# EAGLE design 808sn (EAGLE 7.2.0)
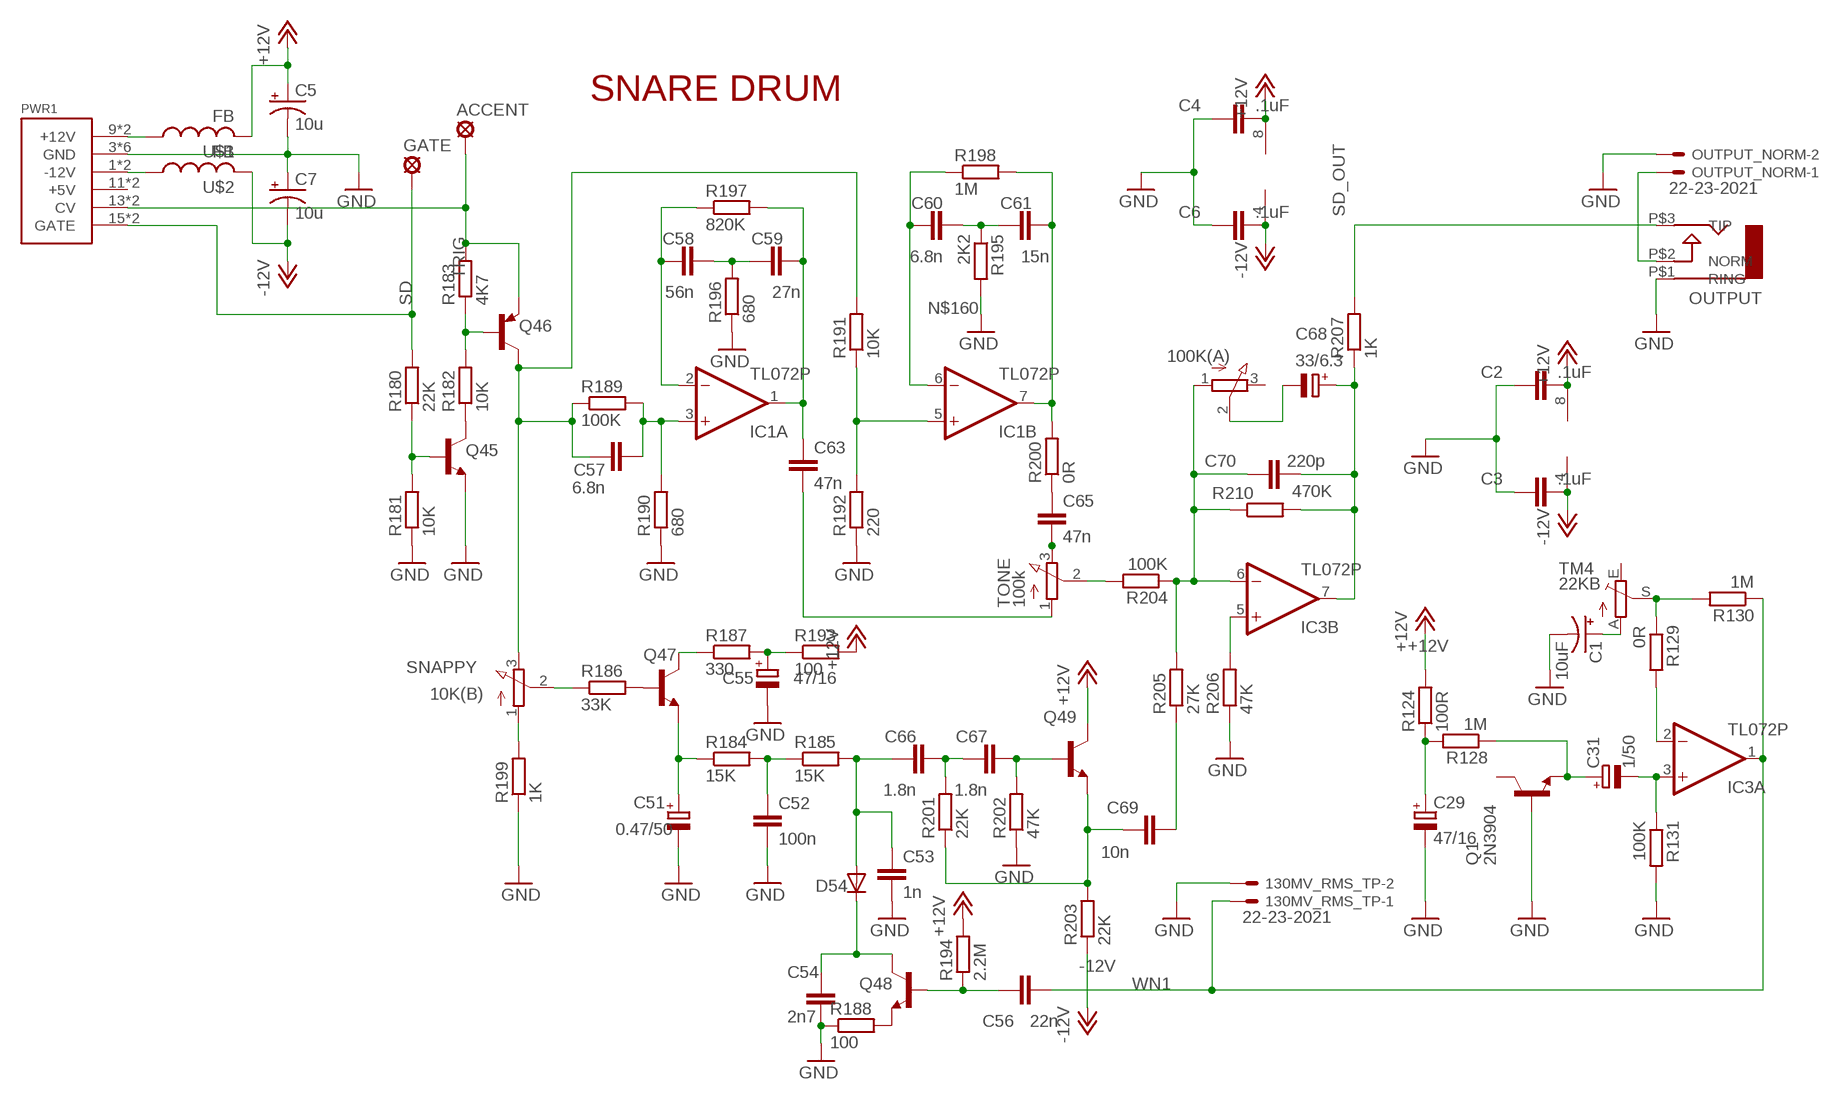
[diagram p0: schematic, sheet 1]

## Parts
130MV_RMS_TP  22-23-2021  [22-23-2021]
ACCENT  LSP10  [LSP10]
C1  10uF  CPOL-USB45181A  [B45181A]
C2  .1uF  C-EU025-025X050  [C025-025X050]
C3  .1uF  C-EU025-025X050  [C025-025X050]
C4  .1uF  C-EU025-025X050  [C025-025X050]
C5  10u  CPOL-USB45181A  [B45181A]
C6  .1uF  C-EU050-025X075  [C050-025X075]
C7  10u  CPOL-USB45181A  [B45181A]
C29  47/16  CPOL-EUE2.5-5  [E2,5-5]
C31  1/50  CPOL-EUE3.5-8  [E3,5-8]
C51  0.47/50  CPOL-EUE3.5-8  [E3,5-8]
C52  100n  C-EU050-045X075  [C050-045X075]
C53  1n  C-EU3.5MM_PITCH  [C035-025X75]
C54  2n7  C-EU3.5MM_PITCH  [C035-025X75]
C55  47/16  CPOL-EUE2-5  [E2-5]
C56  22n  C-EU4MM_PITCH  [C035-030X60]
C57  6.8n  C-EU4MM_PITCH  [C035-030X60]
C58  56n  C-EU050-024X044  [C050-024X044]
C59  27n  C-EU050-024X044  [C050-024X044]
C60  6.8n  C-EU4MM_PITCH  [C035-030X60]
C61  15n  C-EU4MM_PITCH  [C035-030X60]
C63  47n  C-EU050-024X044  [C050-024X044]
C65  47n  C-EU050-024X044  [C050-024X044]
C66  1.8n  C-EU3.5MM_PITCH  [C035-025X75]
C67  1.8n  C-EU3.5MM_PITCH  [C035-025X75]
C68  33/6.3  CPOL-EUE2-5  [E2-5]
C69  10n  C-EU075-042X103  [C075-042X103]
C70  220p  C-EU025-025X050  [C025-025X050]
D54  1N4148DO35-7  [DO35-7]
GATE  LSP10  [LSP10]
IC1  TL072P  [DIL08]
IC3  TL072P  [DIL08]
LEVEL  100K(A)  3RP/1610N  [3RP/1610N]
OUTPUT  AUDIO-JACK  [ERTHENVAR-JACK-90DEG]
OUTPUT_NORM  22-23-2021  [22-23-2021]
PWR1  POWER  [POWER_16]
Q1  2N3904  [TO92]
Q45  2N3904  [TO92]
Q46  2N3906  [TO92]
Q47  2N3904  [TO92]
Q48  2N3904  [TO92]
Q49  2N3904  [TO92]
R124  100R  R-EU_0207/7  [0207/7]
R128  1M  R-EU_0207/7  [0207/7]
R129  0R  R-EU_0207/7  [0207/7]
R130  1M  R-EU_0207/7  [0207/7]
R131  100K  R-EU_0207/7  [0207/7]
R180  22K  R-EU_0207/5V  [0207/5V]
R181  10K  R-EU_0207/5V  [0207/5V]
R182  10K  R-EU_0207/5V  [0207/5V]
R183  4K7  R-EU_0207/2V  [0207/2V]
R184  15K  R-EU_0207/7  [0207/7]
R185  15K  R-EU_0207/7  [0207/7]
R186  33K  R-EU_0309/12  [0309/12]
R187  330  R-EU_0207/7  [0207/7]
R188  100  R-EU_0207/5V  [0207/5V]
R189  100K  R-EU_0207/5V  [0207/5V]
R190  680  R-EU_0207/5V  [0207/5V]
R191  10K  R-EU_0207/5V  [0207/5V]
R192  220  R-EU_0207/5V  [0207/5V]
R193  100  R-EU_0207/7  [0207/7]
R194  2.2M  R-EU_0207/7  [0207/7]
R195  2K2  R-EU_0207/7  [0207/7]
R196  680  R-EU_0207/7  [0207/7]
R197  820K  R-EU_0207/5V  [0207/5V]
R198  1M  R-EU_0207/5V  [0207/5V]
R199  1K  R-EU_0207/5V  [0207/5V]
R200  0R  R-EU_0207/5V  [0207/5V]
R201  22K  R-EU_0207/7  [0207/7]
R202  47K  R-EU_0207/5V  [0207/5V]
R203  22K  R-EU_0207/7  [0207/7]
R204  100K  R-EU_0207/7  [0207/7]
R205  27K  R-EU_0207/7  [0207/7]
R206  47K  R-EU_0207/5V  [0207/5V]
R207  1K  R-EU_0309/10  [0309/10]
R210  470K  R-EU_0207/5V  [0207/5V]
SNAPPY  10K(B)  3RP/1610N  [3RP/1610N]
TM4  22KB  TRIM_EU-B64Y  [B64Y]
TONE  100k  3RP/1610N  [3RP/1610N]
U$1  FB  [FB]
U$2  FB  [FB]

## Nets
+12V: C2.2 C4.2 C5.+ IC1.8(P:V+) IC3.8(P:V+) Q49.1(C) R124.2 R193.2 R194.2 U$1.P$2
-12V: C3.2 C6.2 C7.- IC1.4(P:V-) IC3.4(P:V-) R203.1 U$2.P$2
GND [GND]: 130MV_RMS_TP.2 C1.- C2.1 C3.1 C4.1 C5.- C6.1 C7.+ C29.- C51.- C52.2 C53.P$2 C54.P$2 C55.- OUTPUT.P$1(RING) OUTPUT_NORM.2 PWR1.3(GND) PWR1.4(GND) PWR1.5(GND) PWR1.6(GND) PWR1.7(GND) PWR1.8(GND) Q1.2(B) Q45.3(E) R131.2 R181.1 R188.1 R190.1 R192.1 R195.2 R196.1 R199.1 R202.1 R206.1
N$1: IC3.5(B:+IN) R206.2
N$2: OUTPUT.P$2(NORM) OUTPUT_NORM.1
N$3: C1.+ TM4.A
N$4: IC3.2(A:-IN) R129.2
N$5: Q45.2(B) R180.1 R181.2
N$6: Q46.2(B) R182.2 R183.1
N$7: Q45.1(C) R182.1
N$8: C57.P$2 IC1.3(A:+IN) R189.2 R190.2
N$9: C57.P$1 Q46.1(C) R189.1 R191.2 SNAPPY.3(E)
N$10: PWR1.9(+12V) PWR1.10(+12V) U$1.P$1
N$11: C58.1 IC1.2(A:-IN) R197.1
N$12: C59.2 C63.1 IC1.1(A:OUT) R197.2
N$13: C58.2 C59.1 R196.2
N$14: C61.P$2 IC1.7(B:OUT) R198.2 R200.2
N$15: C60.P$2 C61.P$1 R195.1
N$16: IC1.5(B:+IN) R191.1 R192.2
N$17: C63.2 TONE.1(A)
N$18: C65.2 TONE.3(E)
N$19: C65.1 R200.1
N$20: R199.2 SNAPPY.1(A)
N$21: C52.1 R184.2 R185.1
N$22: R186.1 SNAPPY.2(S)
N$23: Q47.2(B) R186.2
N$24: Q47.1(C) R187.1
N$25: C55.+ R187.2 R193.1
N$26: C51.+ Q47.3(E) R184.1
N$27: C53.P$1 C66.P$1 D54.A R185.2
N$28: C66.P$2 C67.P$1 R201.2
N$29: C67.P$2 Q49.2(B) R202.2
N$30: C69.1 Q49.3(E) R201.1 R203.2
N$31: Q48.3(E) R188.2
N$32: C54.P$1 D54.C Q48.1(C)
N$33: C56.P$1 Q48.2(B) R194.1
N$34: R204.2 TONE.2(S)
N$35: C70.1 IC3.6(B:-IN) LEVEL.1(A) R204.1 R205.2 R210.1
N$36: C69.2 R205.1
N$37: PWR1.1(-12V) PWR1.2(-12V) U$2.P$1
N$129: C68.+ C70.2 IC3.7(B:OUT) R207.1 R210.2
N$159: C68.- LEVEL.2(S)
N$160: C60.P$1 IC1.6(B:-IN) R198.1
N$280: C31.- IC3.3(A:+IN) R131.1
N$490: R129.1 R130.2 TM4.S
N$491: C31.+ Q1.3(E) R128.1
N$492: C29.+ R124.1 R128.2
SD: GATE.MP PWR1.15(GATE) PWR1.16(GATE) R180.2
SD_OUT: OUTPUT.P$3(TIP) R207.2
TRIG: ACCENT.MP PWR1.13(CV) PWR1.14(CV) Q46.3(E) R183.2
WN1: 130MV_RMS_TP.1 C56.P$2 IC3.1(A:OUT) R130.1
Unconnected: LEVEL.3(E) PWR1.11(+5V) PWR1.12(+5V) Q1.1(C) TM4.E

## Notes on the sheet
- SNARE DRUM

## Library data of the parts
130MV_RMS_TP OUTPUT_NORM = con-molex:22-23-2021: .100" (2.54mm) Center Header - 2 Pin; MF: MOLEX; MPN: 22-23-2021; OC_FARNELL: 1462926; OC_NEWARK: 25C3832
ACCENT GATE = solpad:LSP10: SOLDER PAD drill 1.0 mm, distributor Buerklin, 12H555
C1 C5 C7 = rcl:CPOL-US: POLARIZED CAPACITOR, American symbol
C2-C4 C6 C52-C54 C56-C61 C63 C65-C67 C69 C70 = TR808clone:C-EU: CAPACITOR, European symbol Pitch 3mm
C29 C31 C51 C55 C68 = TR808clone:CPOL-EU: POLARIZED CAPACITOR, European symbol
D54 = TR808clone:1N4148: DIODE high speed (Philips)
IC1 IC3 = linear:TL072: OP AMP
LEVEL SNAPPY TONE = pot:3RP/1610N: 16mm Potentiometer one level Source: http://www.alphapotentiometers.net/html/16mm_pot_2.html
OUTPUT = erthenvar:AUDIO-JACK: Switching Mono 3.5mm Audio Jack from Erthenvar.
PWR1 = eurorack:POWER
Q1 = transistor-npn:2N3904: NPN Transistor
Q45 Q47-Q49 = 808_lt:2N3904: NPN Transistor
Q46 = 808_lt:2N3906: PNP Transistor
R124 R128-R131 R180-R207 R210 = TR808clone:R-EU_: RESISTOR, European symbol
TM4 = TR808clone:TRIM_EU-: POTENTIOMETER
U$1 U$2 = adafruit:FB: Ferrite bead Digikey #P9821BK-ND

## Net classes
1 GND: width 1.016 mm, drill 1.016 mm, clearance 0.508 mm
2 Power: width 1.016 mm, drill 1.016 mm, clearance 0.508 mm
3 special: width 0.635 mm, drill 0.254 mm, clearance 0.254 mm
4 15v: width 1.524 mm, drill 1.016 mm, clearance 0.508 mm

## Board
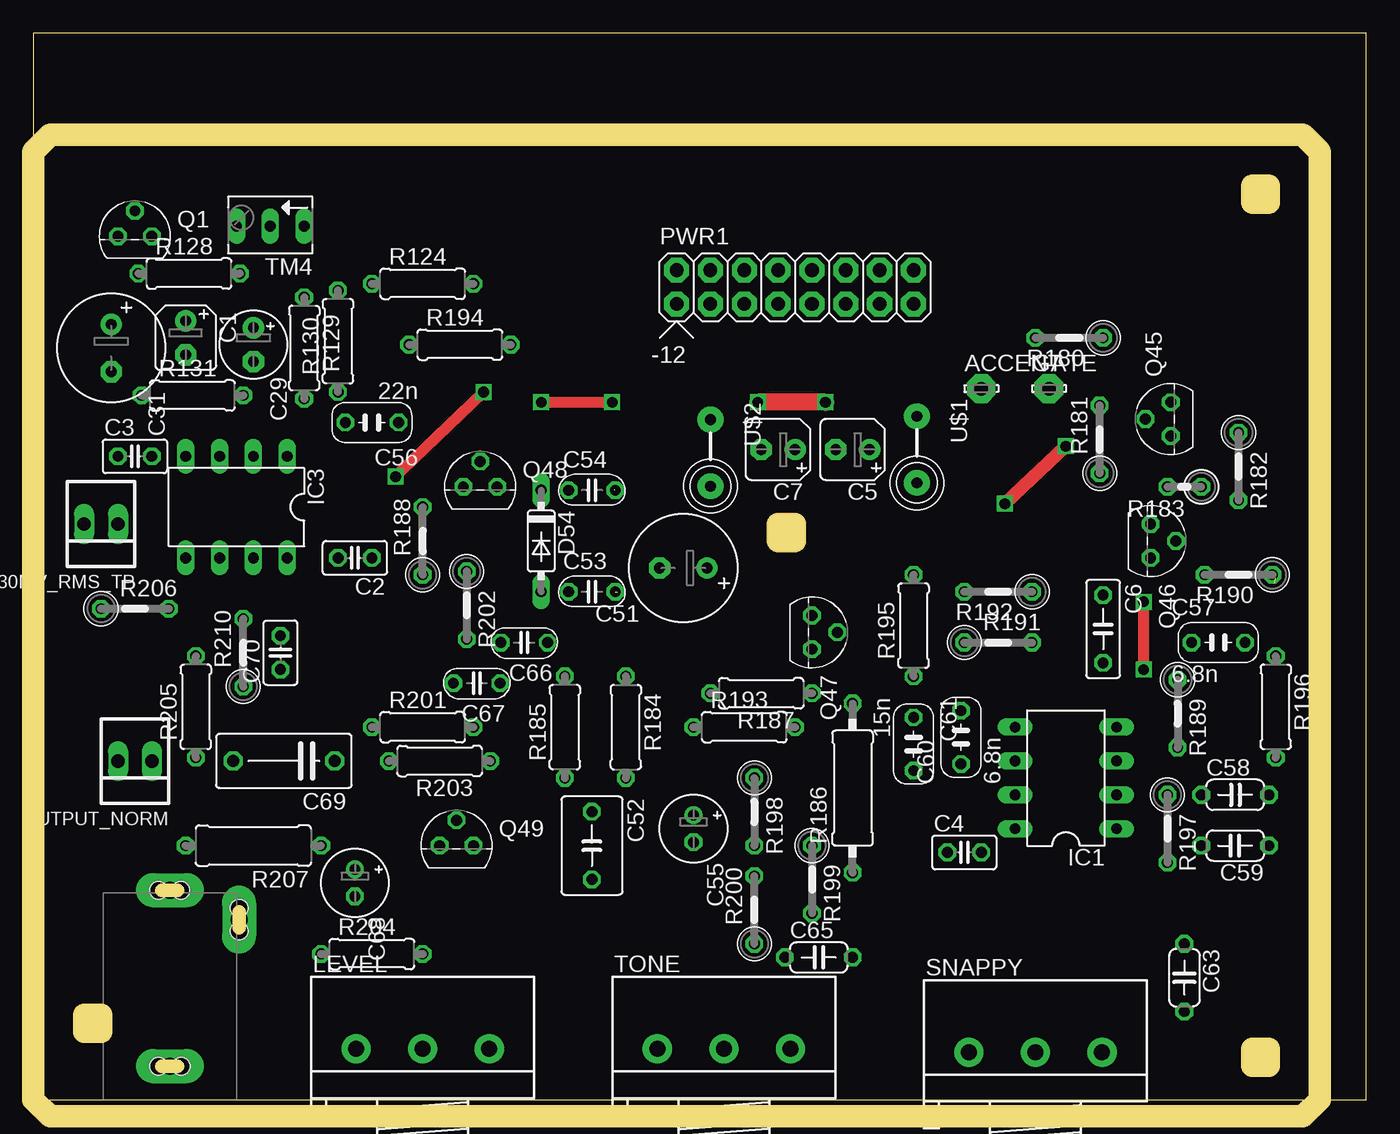
[diagram p1: board, top side]
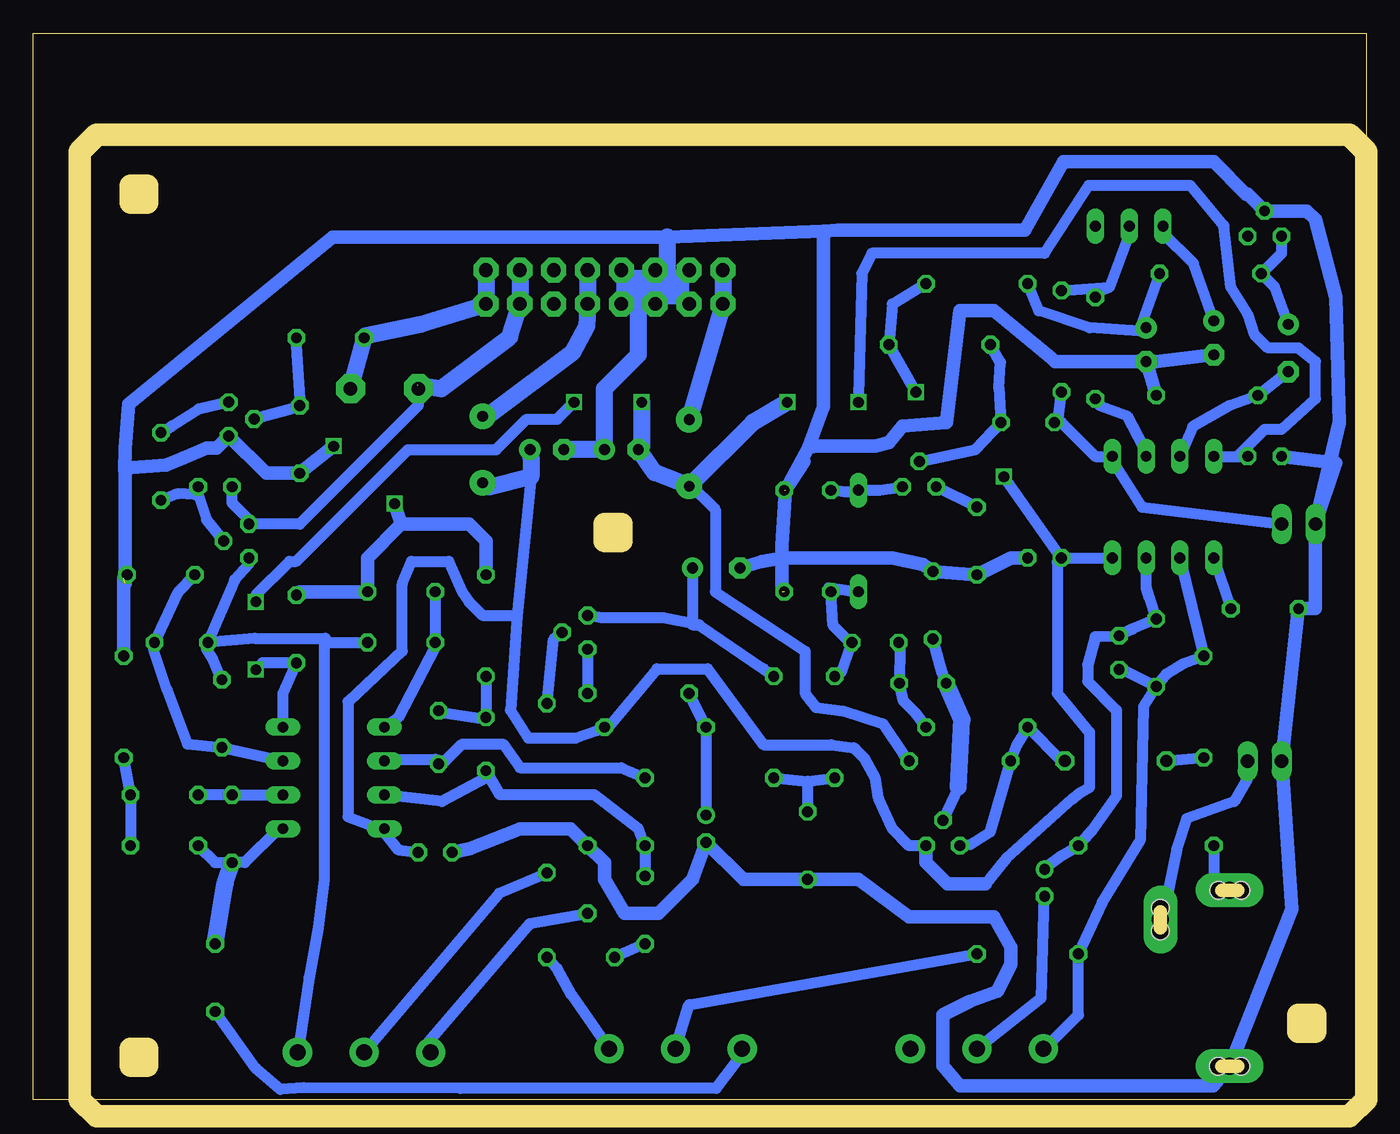
[diagram p2: board, bottom side, seen from below]

Size 100 x 80 mm. Coordinates in mm from the lower left corner, seen from the top.
Outline: 0,0 100,0 100,80 0,80 0,0
Copper layers (1*16): Top 0.035mm / dielectric 1.5mm / Bottom 0.035mm
Design rules "default *": minimum track width 32mil, minimum drill 32mil, track to track 18mil, track to pad 18mil, pad to pad 18mil, via to via 18mil, smd to smd 8mil, copper to edge 0mil, drill to drill 18mil, minimum pad ring 10mil, minimum via ring 8mil, stop-mask expansion 4mil, vias tented up to drill 0mil, thermal gap 10mil
Milling: 24 lines

### Footprints (pad centres in the part's own frame; a part is rotated, then mirrored left to right if it is on the bottom)
22-23-2021 = drill 1 long: 1 -1.27,0; 2 1.27,0
LSP10 = drill 1.016 pad 2.159 octagon: MP 0,0
B45181A = drill 0.813 pad 1.6: + -1.27,0 | drill 0.813 pad 1.6 octagon: - 1.27,0
C025-025X050 = drill 0.813 octagon: 1 -1.27,0; 2 1.27,0
C050-025X075 = drill 0.813 octagon: 1 -2.54,0; 2 2.54,0
E2,5-5 = drill 0.813 pad 1.6: + -1.27,0 | drill 0.813 pad 1.6 octagon: - 1.27,0
E3,5-8 = drill 0.813 pad 1.6: + -1.778,0 | drill 0.813 pad 1.6 octagon: - 1.778,0
C050-045X075 = drill 0.813 octagon: 1 -2.54,0; 2 2.54,0
C035-025X75 = drill 0.8 octagon: P$1 -1.75,0; P$2 1.75,0
E2-5 = drill 0.813 pad 1.27: + -1.016,0 | drill 0.813 pad 1.27 octagon: - 1.016,0
C035-030X60 = drill 0.8 octagon: P$1 -2,0; P$2 2,0
C050-024X044 = drill 0.813 octagon: 1 -2.54,0; 2 2.54,0
C075-042X103 = drill 0.914 octagon: 1 -3.81,0; 2 3.81,0
DO35-7 = drill 0.813 long: A 3.81,0; C -3.81,0
DIL08 = drill 0.813 long: 1 -3.81,-3.81; 2 -1.27,-3.81; 3 1.27,-3.81; 4 3.81,-3.81; 5 3.81,3.81; 6 1.27,3.81; 7 -1.27,3.81; 8 -3.81,3.81
3RP/1610N = drill 1.2 pad 2.184: 1 -5,0; 2 0,0; 3 5,0
ERTHENVAR-JACK-90DEG = drill 1.3 pad 2.54 long: P$1 5,-2.5; P$2 -0.2,-13.5; P$3 5,-15.7 | hole 1.3: 5.842,-2.489; 4.14,-2.489; -0.203,-12.649; -0.203,-14.351; 5.842,-15.697; 4.166,-15.697
POWER_16 = drill 1.016 pad 1.88 octagon: 1 -6.35,-1.27; 2 -6.35,1.27; 3 -3.81,-1.27; 4 -3.81,1.27; 5 -1.27,-1.27; 6 -1.27,1.27; 7 1.27,-1.27; 8 1.27,1.27; 9 3.81,-1.27; 10 3.81,1.27; 11 6.35,-1.27; 12 6.35,1.27; 13 8.89,-1.27; 14 8.89,1.27; 15 11.43,-1.27; 16 11.43,1.27
TO92 = drill 0.813 octagon: 1 1.27,0; 2 0,1.905; 3 -1.27,0
0207/7 = drill 0.813 octagon: 1 -3.81,0; 2 3.81,0
0207/5V = drill 0.813 octagon: 1 -2.54,0; 2 2.54,0
0207/2V = drill 0.813 octagon: 1 -1.27,0; 2 1.27,0
0309/12 = drill 0.813 octagon: 1 -6.35,0; 2 6.35,0
0309/10 = drill 0.813 octagon: 1 -5.08,0; 2 5.08,0
B64Y = drill 0.813 long: A 2.54,0; E -2.54,0; S 0,0
FB = drill 0.8 pad 1.93: P$1 -2.5,0; P$2 2.5,0

### Placement (x,y rotation side)
130MV_RMS_TP  5.08,43.18 180 top
ACCENT  71.12,53.34 0 top
C1  11.43,57.15 270 top
C2  24.13,40.64 180 top
C3  7.62,48.26 0 top
C4  69.85,18.54 0 top
C5  61.47,48.77 180 top
C6  80.26,35.31 270 top
C7  55.88,48.77 180 top
C29  16.51,56.64 270 top
C31  5.84,56.39 270 top
C51  48.77,39.88 180 top
C52  41.91,19.05 270 top
C53  41.91,38.1 0 top
C54  41.91,45.72 0 top
C55  49.53,20.32 270 top
C56  25.4,50.8 180 top
C57  88.9,34.29 0 top
C58  90.17,22.86 0 top
C59  90.17,19.05 180 top
C60  69.6,27.18 90 top
C61  66.04,26.67 270 top
C63  86.36,9.14 270 top
C65  58.93,10.67 0 top
C66  36.83,34.29 180 top
C67  33.27,31.24 180 top
C68  24.13,16.26 270 top
C69  18.8,25.4 180 top
C70  18.54,33.53 90 top
D54  38.1,41.91 270 top
GATE  76.2,53.34 0 top
IC1  77.47,24.13 90 top
IC3  15.24,44.45 180 top
LEVEL  29.21,3.81 0 top
OUTPUT  15.24,0 180 top
OUTPUT_NORM  7.62,25.4 180 top
PWR1  54.61,60.96 0 top
Q1  7.62,64.77 0 top
Q45  85.34,51.05 90 top
Q46  83.82,41.91 270 top
Q47  58.42,35.05 270 top
Q48  33.53,45.97 0 top
Q49  31.75,19.05 0 top
R124  29.21,61.21 0 top
R128  11.68,61.98 0 top
R129  20.32,56.39 270 top
R130  22.86,56.9 90 top
R131  11.94,52.83 0 top
R180  77.72,57.15 180 top
R181  80.01,49.53 90 top
R182  90.42,47.5 270 top
R183  86.36,45.97 180 top
R184  44.45,27.94 270 top
R185  39.88,27.94 90 top
R186  61.47,23.37 90 top
R187  54.61,30.48 180 top
R188  29.21,41.91 90 top
R189  85.85,28.96 270 top
R190  90.42,39.37 180 top
R191  72.39,34.29 0 top
R192  72.39,38.1 180 top
R193  53.34,27.94 0 top
R194  32,56.64 0 top
R195  66.04,35.56 90 top
R196  93.22,29.46 270 top
R197  85.09,20.32 270 top
R198  54.1,21.59 270 top
R199  58.42,16.51 270 top
R200  54.1,14.22 90 top
R201  29.21,27.94 0 top
R202  32.51,37.08 270 top
R203  30.48,25.4 180 top
R204  25.4,10.92 0 top
R205  12.19,29.46 90 top
R206  7.62,36.83 0 top
R207  16.51,19.05 180 top
R210  15.75,33.53 90 top
SNAPPY  75.18,3.56 0 top
TM4  17.78,65.53 180 top
TONE  51.82,3.81 0 top
U$1  66.29,48.77 270 top
U$2  50.8,48.51 270 top

### Tracks (layer width: path | path; a pad name or v marks a point on that pad's centre or on a via)
+12V  (via drill 0.8)
  Top 0.813: v27.18,46.74 27.69,47.24 v33.78,53.09
  Bottom 0.813: 28.57,16.19 28.26,16.51 26.99,18.1 22.04,22.54 21.4,23.05 20.77,23.43 20.77,27.56 23.18,30.48 23.18,40.32 C2.2 | C2.2 IC3.8 | C4.2 72.64,18.73 73.66,20 IC1.8 73.98,20.32 76.39,21.21 76.39,29.84 72.33,33.66 72.33,38.67 71.63,40.39 68.83,40.39 67.82,38.1 67.31,37.34 66.29,36.32 63.69,36.32 | 62.67,46.74 63.69,36.32 | 63.69,36.32 64.2,29.21 62.87,27.11 59.31,27.11 57.72,27.69 R193.2 56.83,27.94 53.21,32.32 49.4,32.32 45.21,26.61 40.13,26.61 38.44,26.4 | C5.+ 62.67,48.2 | 65.79,45.97 U$1.P$2 | 38.44,26.4 38.29,26.29 | R124.2 35.56,59.69 R194.2 v33.78,53.09 | Q49.1 34.29,19.05 35.56,20.32 36.58,22.61 36.83,24.13 37.59,25.55 38.44,26.4 | C2.2 v27.18,46.74
  Bottom 1.016: 28.57,16.19 31.43,16.19 33.02,17.78 Q49.1
  Bottom 1.27: 62.67,48.2 62.67,46.74 65.79,45.97
-12V  (via drill 0.8)
  Top 0.813: v83.31,32.26 v83.31,37.34 | v38.1,52.32 v43.43,52.32
  Top 1.27: v59.44,52.32 v54.36,52.32
  Bottom 0.813: U$2.P$2 50.8,46.23 48.83,44.26 48.83,38.1 42.1,33.66 42.1,30.48 41.27,29.4 39.24,29.15 36.26,28.19 34.73,25.91 R203.1 | C3.2 IC3.4 9.65,48.26 7.62,50.29 6.35,50.29 3.81,52.58 3.81,55.37 5.08,56.39 7.37,56.39 8.38,57.4 8.89,58.93 10.16,60.96 10.67,65.53 13.21,68.58 20.83,68.58 24.13,63.5 37.08,63.5 37.85,61.98 38.1,52.83 v38.1,52.32 | IC1.4 81.28,30.48 C6.2 82.8,32.77 v83.31,32.26 | v83.31,37.34 83.31,37.85 80.77,40.39 80.26,40.39 71.88,48.77 65.28,48.77 62.99,51.05 60.71,51.05 v59.44,52.32 | 54.36,49.02 C7.-
  Bottom 1.27: C7.- 53.38,47.03 U$2.P$2 46.01,50.8 v43.43,52.32 | v54.36,52.32 54.36,49.02
GND  (via drill 0.8)  (3 unrouted)
  Top 1.016: v77.47,49.02 v72.9,44.7
  Bottom 0.813: 52.45,61.34 PWR1.3 | 52.45,61.34 PWR1.6 | PWR1.8 PWR1.7 54.61,60.96 | PWR1.4 PWR1.5 54.61,60.96 | 52.45,61.34 54.23,61.34 | 54.23,61.34 54.61,60.96 | 54.23,61.34 54.99,61.34 PWR1.8 | PWR1.8 54.61,60.96
  Bottom 1.016: 93.09,47.37 90.04,47.62 88.77,48.13 87,48.9 86.23,48.9 Q45.3 82.55,46.99 R181.1 v77.47,49.02 | 93.09,38.73 93.09,47.37 | 43.56,45.72 42.16,47.88 | 43.81,38.1 43.81,40.64 | 43.81,40.64 43.81,41.59 43.56,45.72 | 43.56,45.72 41.85,48.91 | 41.85,48.91 40.7,52.01 40.7,65.15 | 43.81,40.64 35.56,40.64 33.27,40.13 R202.1 R188.1 26.67,40.64 C2.1 | 40.7,65.15 52.45,64.71 77.53,64.71 92.84,52.2 93.09,48.9 93.15,47.18 93.15,47.43 93.09,47.37 | 40.7,65.15 39.62,65.22 25.59,65.22 22.73,70.36 11.43,70.36 9.02,67.94 8.89,67.94 Q1.2 4.45,66.67 3.81,66.04 2.29,60.2 2.03,50.8 130MV_RMS_TP.2 | C51.- 45.34,40.39 43.81,40.64 | 130MV_RMS_TP.2 2.29,47.75 C3.1 | R195.2 66.04,41.91 67.31,43.18 72.39,43.18 | 72.39,43.18 74.93,40.64 R192.1 80.01,38.1 C6.1 | v72.9,44.7 72.39,43.18 | C4.1 67.31,18.8 63.5,20.32 59.69,20.32 R199.1 57.15,17.78 57.15,16.51 55.63,13.97 53.09,13.97 50.55,16.51 C55.- 46.74,16.51 C52.2 38.1,16.51 34.29,13.72 27.94,13.72 26.67,11.43 26.67,10.16 27.69,8.13 29.72,7.37 31.75,6.35 31.75,2.54 30.48,1.02 11.47,1.02 OUTPUT.P$1 5.59,14.26 OUTPUT_NORM.2 R206.1 3.81,36.83 130MV_RMS_TP.2 | R196.1 93.22,39.12 R190.1 | 41.85,48.91 41.2,49.02 36.83,49.02 35.81,49.28 34.8,50.55 31.5,50.8 30.48,59.18 27.94,59.18 23.62,55.63 23.37,55.37 C29.- | C1.- 15.75,55.37 C29.- | R131.2 16.26,54.61 C29.-
  Bottom 1.27: 52.45,64.71 52.45,61.34 | 54.61,60.96 54.61,55.88 57.15,53.34 C7.+ C5.-
N$1
  Bottom 0.813: IC3.5 R206.2
N$2
  Bottom 0.813: OUTPUT_NORM.1 8.89,24.13 9.91,22.35 13.46,21.08 14.22,18.8 15.24,13.7 OUTPUT.P$2
N$3
  Bottom 0.813: C1.+ 12.95,62.74 15.24,65.02 TM4.A
N$4
  Bottom 0.813: IC3.2 16.7,48.96 17.97,51.31 20,52.07 R129.2
N$5
  Bottom 0.813: 79.95,52.01 R181.2 | 79.95,52.01 Q45.2 | 79.95,52.01 R180.1
N$6
  Bottom 0.813: Q46.2 87,43.5 87.63,45.4 | R183.1 87.63,45.4 | R182.2 89.15,45.47 87.95,45.4 87.63,45.4
N$7
  Bottom 0.813: R182.1 89.6,50.55 87.57,51.82 Q45.1
N$8
  Bottom 0.813: IC1.3 R189.2 88.46,26.67 89.95,30.7 90.96,33.72 C57.P$2 89.12,38.07 R190.2
N$9
  Bottom 0.813: R189.1 86.49,32.89 87,33.78 C57.P$1 | 77.79,34.29 78.17,34.29 78.17,16.51 78.61,12.89 79.31,9.14 80.01,4.32 SNAPPY.3 | 77.79,34.29 R191.2 | 77.79,34.29 78.11,34.61 83.38,34.61 C57.P$1 | Q46.1 83.82,40.2 84.9,38.99 C57.P$1
N$10
  Bottom 0.813: 65.53,51.56 U$1.P$1 | 58.42,59.37 PWR1.9
  Bottom 1.27: PWR1.10 PWR1.9 | 65.53,51.56 59.56,56.01 58.48,58.04 58.42,59.37
N$11
  Bottom 0.813: IC1.2 R197.1 C58.1
N$12
  Bottom 0.813: C59.2 86.36,17.78 R197.2 84.14,17.78 81.6,20.32 IC1.1
  Bottom 1.27: C63.1 85.6,16.26 R197.2
N$13
  Bottom 0.813: R196.2 C58.2 C59.1
N$14
  Bottom 0.813: R200.2 R198.2 54.61,20.32 57.91,22.86 64.99,22.86 C61.P$2 66.04,24.13 69.34,22.35 IC1.7
N$15
  Bottom 0.813: R195.1 C61.P$1 66.36,28.57 69.85,29.08 C60.P$2
N$16
  Bottom 0.813: R192.2 R191.1 69.85,33.97 72.64,28.64 IC1.5
N$17
  Bottom 0.813: C63.2 83.31,2.35 81.47,0.76 79.69,0.89 67.94,0.83 48.77,0.83 46.55,3.81 TONE.1
N$18
  Bottom 0.813: C65.2 60.71,9.84 59.63,7.87 TONE.3
N$19
  Bottom 0.813: R200.1 C65.1
N$20
  Bottom 0.813: R199.2 62.74,13.21 70.36,4.32 SNAPPY.1
N$21
  Bottom 0.813: R184.2 41.91,23.88 | 41.91,23.88 R185.1 | 41.91,23.88 C52.1
N$22
  Bottom 0.813: R186.1 65.02,15.49 SNAPPY.2
N$23
  Bottom 0.813: Q47.2 60.96,34.54 R186.2
N$24
  Bottom 0.813: Q47.1 R187.1
N$25
  Bottom 0.813: C55.+ R193.1 R187.2
N$26
  Bottom 0.813: R184.1 45.21,32.32 50.04,35.62 | Q47.3 57.34,36.13 52.7,36.13 50.04,35.62 | C51.+ 50.55,35.62 50.04,35.62
N$27
  Bottom 0.813: 38.73,34.29 C66.P$1 | 38.73,34.29 40.01,35.56 C53.P$1 40.32,38.42 D54.A | R185.2 39.37,32.07 38.73,33.97 38.73,34.29
N$28
  Bottom 0.813: C66.P$2 35.24,34.29 34.99,34.04 C67.P$1 34.73,29.91 33.78,28.96 R201.2
N$29
  Bottom 0.813: 30.61,23.43 Q49.2 | C67.P$2 31.78,31.98 R202.2
  Bottom 1.27: 30.61,23.43 30.32,28.51 C67.P$2
N$30
  Bottom 0.813: Q49.3 29.72,19.11 28.19,20.07 R203.2 26.16,26.67 R201.1 22.86,25.4 C69.1
N$31
  Bottom 0.813: R188.2 Q48.3
N$32
  Bottom 0.813: C54.P$1 39.12,45.59 38.48,45.59 D54.C 36.51,45.72 Q48.1
N$33
  Bottom 0.813: Q48.2 29.34,48.77 C56.P$1 27.56,53.4 27.43,55.31 R194.1
N$34
  Bottom 0.813: R204.2 50.8,7.11 TONE.2
N$35
  Bottom 0.813: LEVEL.1 24.13,3.81 21.59,6.35 R204.1 19.81,14.8 16.95,19.43 16.7,29.46 R210.1 | R210.1 18.29,32.26 C70.1 | IC3.6 R205.2 13.72,32.7 14.99,31.94 R210.1
N$36
  Bottom 0.813: C69.2 R205.1
N$37
  Bottom 1.27: PWR1.2 PWR1.1 U$2.P$1
N$129
  Bottom 0.813: C68.+ 23.88,17.53 22.86,18.29 R207.1 20.57,20.19 18.73,22.8 18.73,29.21 20.89,31.37 20.89,32.64 20.32,34.73 C70.2 17.53,35.31 R210.2 16.26,37.66 16.51,38.42 IC3.7
N$159
  Bottom 0.813: C68.- 24.38,7.62 LEVEL.2
N$160
  Bottom 0.813: 69.85,25.53 73.03,25.53 IC1.6 | 69.85,25.53 C60.P$1 | 69.85,25.53 69.09,25.4 67.82,26.67 64.77,26.67 63.5,24.89 55.88,24.89 R198.1
N$280
  Bottom 0.813: C31.- R131.1 10.22,52.07 13.02,50.48 IC3.3
N$490
  Bottom 0.813: TM4.S 17.97,65.6 17.72,65.02 19.24,60.96 | R130.2 19.24,60.96 | R129.1 20.32,59.94 20,60.64 19.24,60.96
N$491
  Bottom 0.813: C31.+ 6.86,60.96 R128.1 6.35,63.5 Q1.3
N$492
  Bottom 0.813: R124.1 24.57,59.18 20.77,57.91 17.02,57.66 | C29.+ 17.02,57.66 | 17.02,57.66 R128.2
SD
  Bottom 0.813: 75.09,57.31 R180.2
  Bottom 1.27: PWR1.16 PWR1.15 70.93,58.17 75.09,57.31 GATE.MP
SD_OUT
  Bottom 0.813: R207.2 11.43,16.89 OUTPUT.P$3
TRIG  (1 unrouted)
  Bottom 0.813: R183.2 85.09,44.77 83.82,43.5 Q46.3 80.01,43.18 71.12,52.07 ACCENT.MP 71.12,53.66
  Bottom 1.27: PWR1.14 PWR1.13 64.26,57.21 69.41,53.34 71.18,53.59
WN1
  Bottom 0.813: 23.18,50.8 22.92,53.02 R130.1 | 23.18,50.8 22.86,50.8 20.32,48.26 IC3.1 19.05,47.94 16.83,44.45 130MV_RMS_TP.1 | 23.18,50.8 C56.P$2
(copper drawn outside any net)
  shapes: Bottom area x1